# EAGLE design HelveTiny85_3.3V (EAGLE 8.5.2)

## Sheet 1 of 2
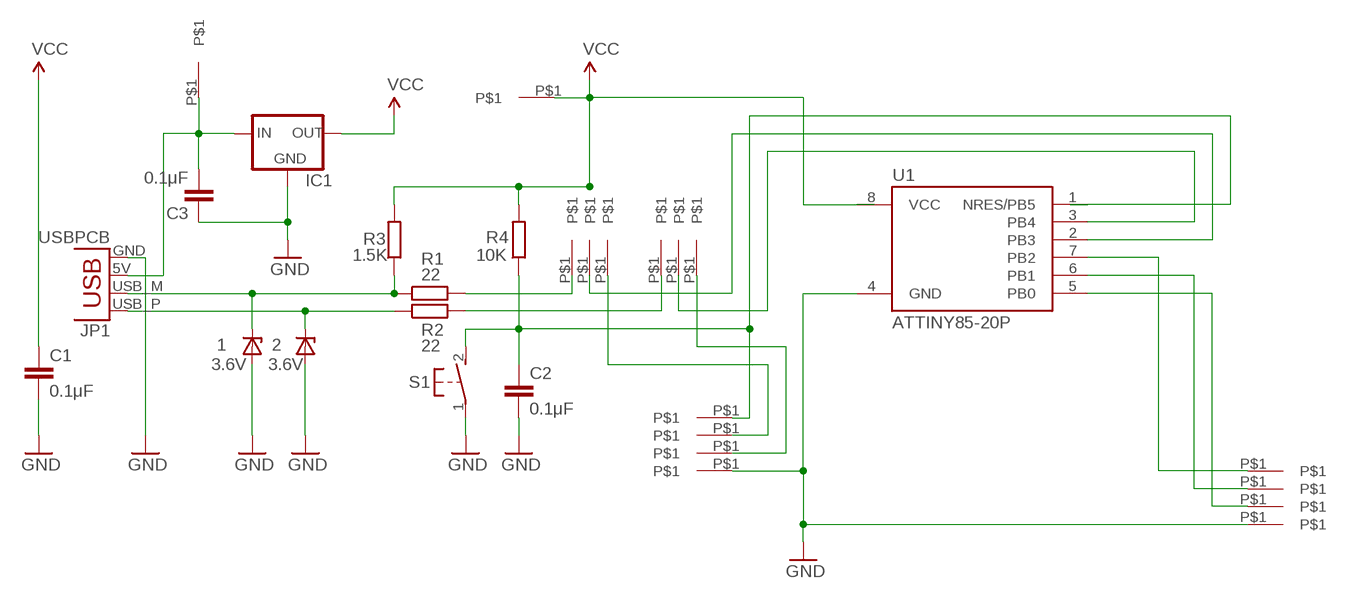
[diagram p0: schematic, sheet 1]

### Parts
1  3.6V  ZENER-DIODEZD-7.5  [ZDIO-7.5]
2  3.6V  ZENER-DIODEZD-7.5  [ZDIO-7.5]
C1  0.1μF  C-EU025-024X044  [C025-024X044]
C2  0.1μF  C-EU025-024X044  [C025-024X044]
C3  0.1μF  C-EU025-024X044  [C025-024X044]
IC1  MCP1700TRI  [TO92]
JP1  USBPCB  [USB-A-PCB]
R1  22  R-EU_0207/7  [0207/7]
R2  22  R-EU_0207/7  [0207/7]
R3  1.5K  R-EU_0207/7  [0207/7]
R4  10K  R-EU_0207/7  [0207/7]
S1  S3  DTS-3  [DTS-3]
TP1  FLOWERPIN  [FLOWERPIN]
TP2  FLOWERPIN  [FLOWERPIN]
TP3  FLOWERPIN  [FLOWERPIN]
TP4  FLOWERPIN  [FLOWERPIN]
TP5  FLOWERPIN  [FLOWERPIN]
TP6  FLOWERPIN  [FLOWERPIN]
TP7  FLOWERPIN  [FLOWERPIN]
TP8  FLOWERPIN  [FLOWERPIN]
TP29  FLOWERPIN  [FLOWERPIN]
TP30  FLOWERPIN  [FLOWERPIN]
TP31  FLOWERPIN  [FLOWERPIN]
TP32  FLOWERPIN  [FLOWERPIN]
TP33  FLOWERPIN  [FLOWERPIN]
TP34  FLOWERPIN  [FLOWERPIN]
TP35  FLOWERPIN  [FLOWERPIN]
TP36  FLOWERPIN  [FLOWERPIN]
U1  ATTINY85-20P  [PDIP08_300MIL]

### Nets
GND: 1.A 2.A C1.2 C2.2 C3.1 IC1.1(GND) JP1.GND S1.1 TP7.P$1 TP32.P$1 U1.4(GND)
N$1: R1.2 TP2.P$1
N$2: TP1.P$1 TP3.P$1
N$5: TP6.P$1 TP31.P$1
N$6: R2.2 TP4.P$1
PB0: TP35.P$1 U1.5(PB0)
PB1: TP34.P$1 U1.6(PB1)
PB2: TP33.P$1 U1.7(PB2)
RESET: C2.1 R4.1 S1.2 TP29.P$1 U1.1(NRES/PB5)
USB-IN-M: 1.C JP1.USB_M(D-) R1.1 R3.1
USB-IN-P: 2.C JP1.USB_P(D+) R2.1
USB-M: TP30.P$1 U1.2(PB3)
USB-P: TP5.P$1 U1.3(PB4)
VCC: C1.1 IC1.3(OUT) R3.2 R4.2 TP36.P$1 U1.8(VCC)
VIN: C3.2 IC1.2(IN) JP1.5V(VBUS) TP8.P$1

## Sheet 2 of 2

## Library data of the parts
1 2 = mod_diode:ZENER-DIODE: Z-Diode
C1-C3 = rcl:C-EU: CAPACITOR, European symbol
IC1 = adafruit:MCP1700: VOLTAGE REGULATOR
JP1 = SparkFun-Connectors:USB: USB Connectors USB-B-PTH is fully proven SKU : PRT-00139/CONN-08278 USB-miniB is fully proven SKU : PRT-00587 USB-A-PCB is untested. USB-A-H is throughly reviewed, but untested. Spark Fun Electronics SKU : PRT-00437 USB-B-SMT is throughly reviewed, but untested. Needs silkscreen touching up. USB-A-S has not been used/tested USB-MB-H has not been used/tested USB-MICROB has been used. CONN-09505
R1-R4 = rcl:R-EU_: RESISTOR, European symbol
S1 = switch-tact:DTS-3
TP1-TP7 TP29-TP36 = ZZFlowerpad:FLOWERPIN: Flower Pad Prototype
TP8 = ZZFlowerpad:FLOWERPIN: Flower Pad Prototype; SPICEPREFIX: X
U1 = _hhn_attiny25_45_85:ATTINY85*: ATMEL ATtiny 85 Packages: P = PDIP 08 30mil S = SOIC 08 EIAJ 208mil Technologies Note: for complete ordering code (temp. range, finish, tape&reel etc.) see www.atmel.com • Supply Voltage: V = (1.8…5.5)V | [blank] = (2.7…5.5)V • Speed: 10 = 10 MHz | 20 = 20 MHz Author: Dipl.-Ing. FH Rainer Bayer HHN Hochschule Heilbronn (Heilbronn University), rainer.bayer@hs-heilbronn.de Ingenieurbüro ing-rb, mail@ing-rb.de

## Board
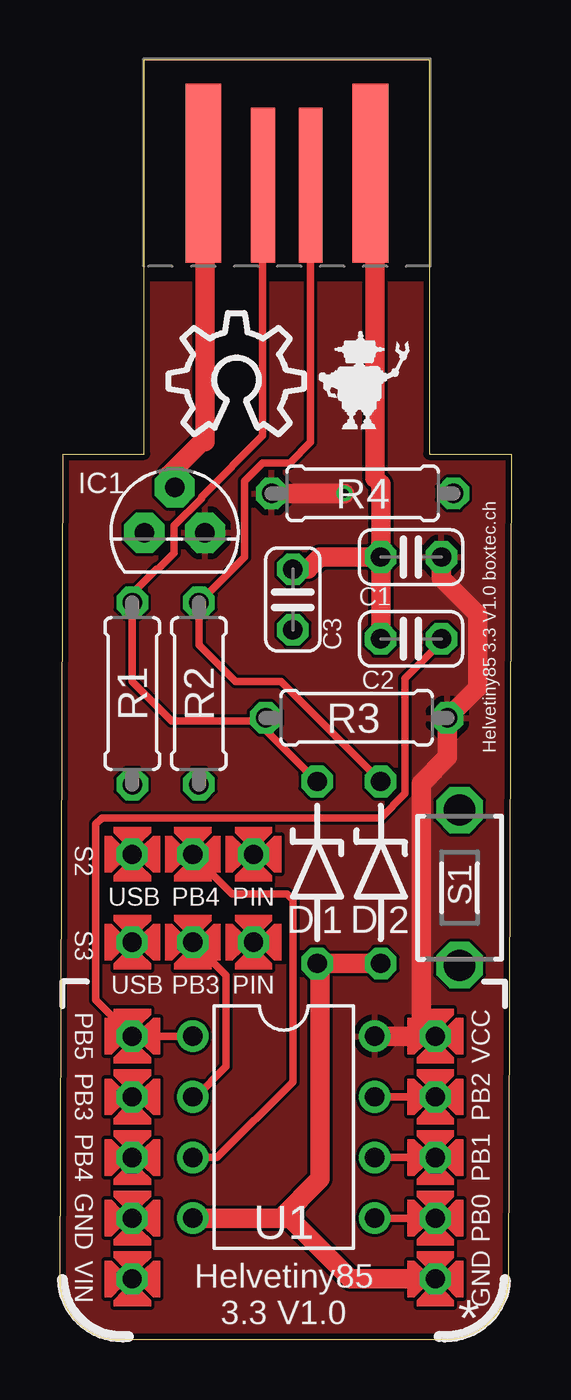
[diagram p1: board, top side]
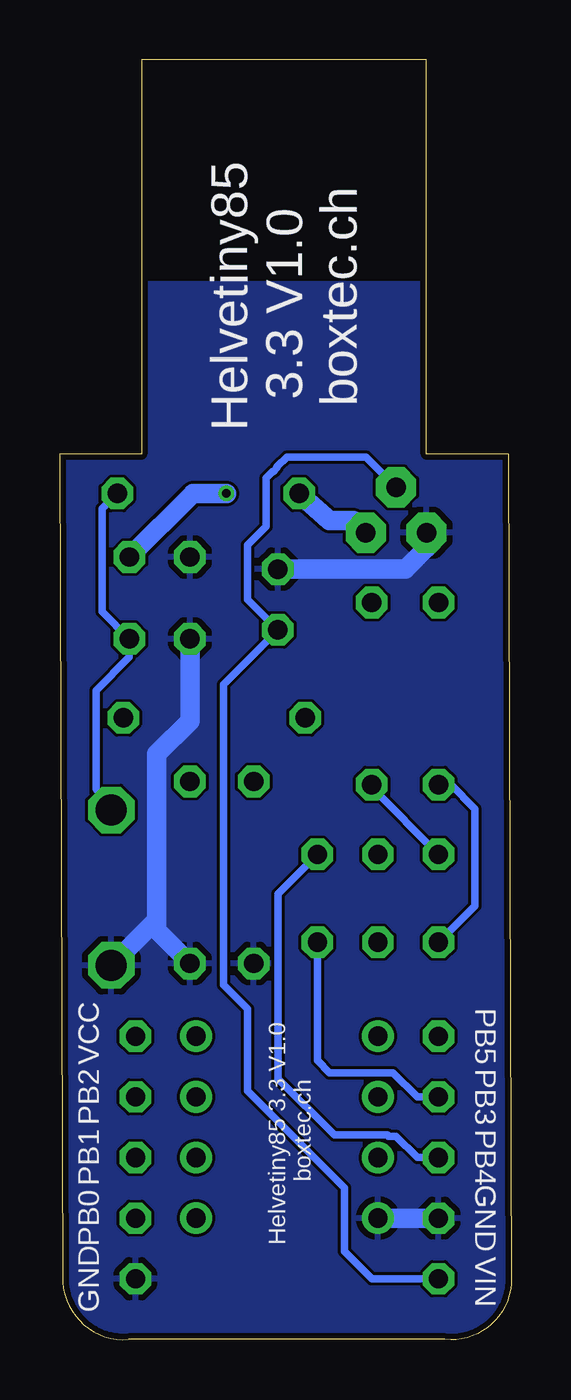
[diagram p2: board, bottom side, seen from below]

Size 18.92 x 53.61 mm. Coordinates in mm from the lower left corner, seen from the top.
Outline: 18.92,37.09 18.8,2.4 arc-90 16.02,0.01 2.77,0.01 arc-90 0,2.28 0.12,37.1
Outline: 18.92,37.1 15.49,37.1 15.49,53.61 3.55,53.61 3.55,37.1 0.12,37.1
Copper layers (1*16): Top 0.035mm / dielectric 1.5mm / Bottom 0.035mm
Design rules "dirt_cheap_dirty_boards.v1": minimum track width 5mil, minimum drill 12mil, track to track 5mil, track to pad 5mil, pad to pad 5mil, via to via 5mil, smd to smd 0mil, copper to edge 10mil, drill to drill 10mil, minimum pad ring 10mil, minimum via ring 6mil, stop-mask expansion 2mil, vias tented up to drill 25mil, thermal gap 10mil

### Footprints (pad centres in the part's own frame; a part is rotated, then mirrored left to right if it is on the bottom)
ZDIO-7.5 = drill 0.813 octagon: A 3.81,0; C -3.81,0
C025-024X044 = drill 0.813 octagon: 1 -1.27,0; 2 1.27,0
TO92 = drill 0.813 pad 1.676 octagon: 1 -1.27,0; 2 0,1.905; 3 1.27,0
USB-A-PCB = smd 7.5 x 1.5: 5V -0.2,-3.5; GND -0.2,3.5 | smd 6.5 x 1: USB_M 0.3,-1; USB_P 0.3,1
0207/7 = drill 0.813 octagon: 1 -3.81,0; 2 3.81,0
DTS-3 = drill 1.3 octagon: 1 -3.25,0; 2 3.25,0
FLOWERPIN = drill 0.8 octagon: P$1 0,0
PDIP08_300MIL = drill 0.813: 1 -3.81,-3.81; 2 -1.27,-3.81; 3 1.27,-3.81; 4 3.81,-3.81; 5 3.81,3.81; 6 1.27,3.81; 7 -1.27,3.81; 8 -3.81,3.81

### Placement (x,y rotation side)
1  10.79,19.57 270 top
2  13.45,19.57 270 top
C1  14.72,32.78 180 top
C2  14.72,29.35 180 top
C3  9.77,31 270 top
IC1  4.82,33.79 0 top
JP1  9.52,48.65 270 top
R1  3.04,27.06 270 top
R2  5.83,27.06 270 top
R3  12.44,26.05 0 top
R4  12.69,35.45 180 top
S1  16.76,18.94 90 top
TP1  8.12,16.65 0 top
TP2  3.04,16.65 0 top
TP3  3.04,10.17 0 top
TP4  3.04,20.33 0 top
TP5  5.58,20.33 0 top
TP6  8.12,20.33 0 top
TP7  15.74,2.55 0 top
TP8  3.04,2.55 0 top
TP29  3.04,12.71 0 top
TP30  5.58,16.65 0 top
TP31  3.04,7.63 0 top
TP32  3.04,5.09 0 top
TP33  15.74,10.17 0 top
TP34  15.74,7.63 0 top
TP35  15.74,5.09 0 top
TP36  15.74,12.71 0 top
U1  9.39,8.9 270 top
U$1  [OSHW_10X200_NOTEXT]  4.56,37.92 0 top

### Tracks (layer width: path | path; a pad name or v marks a point on that pad's centre or on a via)
GND
  Top 0.813: 2.A 1.A 10.91,15.63 10.91,6.74 9.26,5.09 | C1.2 C2.2 | C1.2 13.45,35.83 13.2,36.08 13.2,48.67 JP1.GND | C3.1 10.41,32.27 10.91,32.78 C1.2 | U1.4 9.26,5.09 | 9.26,5.09 9.64,5.09 12.18,2.55 TP7.P$1
  Bottom 0.813: TP32.P$1 U1.4 | C2.2 13.45,25.92 14.85,24.52 14.85,17.59 | 14.85,17.59 S1.1 | 14.85,17.59 14.85,17.16 2.A | IC1.1 3.55,33.16 4.44,32.27 C3.1
  pour Bottom: 3.68,44.21 15.36,44.21 15.36,36.97 18.79,36.97 18.67,2.38 arc-90 16.04,0.14 2.59,0.14 arc-90 0.13,2.23 0.25,36.97 3.68,36.97
N$1
  Bottom 0.305: R1.2 2.53,23.25 1.52,22.24 1.52,18.17 TP2.P$1
N$2
  Bottom 0.305: TP3.P$1 3.93,10.17 4.95,11.19 7.61,11.19 8.12,11.7 TP1.P$1
N$5
  Bottom 0.305: TP31.P$1 3.93,7.63 4.82,8.52 5.14,8.52 5.19,8.57 7.41,8.57 9.77,10.93 9.77,18.68 TP6.P$1
N$6
  Bottom 0.305: R2.2 5.83,23.13 TP4.P$1
PB0
  Top 0.305: U1.5 TP35.P$1
PB1
  Top 0.305: U1.6 TP34.P$1
PB2
  Top 0.305: U1.7 TP33.P$1
RESET
  Top 0.305: U1.1 TP29.P$1 1.52,14.24 1.52,21.6 1.77,21.86 13.45,21.86 14.47,22.87 14.47,27.7 15.99,29.22 C2.1
  Bottom 0.305: R4.1 17.14,34.81 17.14,30.49 C2.1 15.99,28.59 17.39,27.19 17.39,23.07 S1.2
USB-IN-M
  Top 0.305: 1.C 8.63,25.54 R3.1 8.5,25.92 4.69,25.92 3.04,27.57 R1.1 3.04,31.25 4.06,32.27 4.18,32.34 4.79,32.95 4.79,34.09 5.94,35.24 5.94,35.29 8.5,37.86 8.5,46.37 | 8.5,46.37 8.5,46.88 | 8.5,46.37 8.52,46.38 JP1.USB_M
USB-IN-P
  Top 0.305: JP1.USB_P 10.52,37.59 9.64,36.72 8.5,36.72 7.74,35.95 7.74,32.78 R2.1 5.83,29.1 7.36,27.57 9.26,27.57 2.C
USB-M
  Top 0.305: U1.2 5.71,10.17 6.98,11.44 6.98,15.25 TP30.P$1
USB-P
  Top 0.305: U1.3 6.6,7.63 9.77,10.81 9.77,18.43 9.52,18.68 7.23,18.68 TP5.P$1
VCC  (via drill 0.35)
  Top 0.813: U1.8 TP36.P$1 15.16,13.3 15.16,23.3 16.25,24.4 R3.2 17.52,27.32 17.52,30.37 15.99,31.89 C1.1 | R4.2 v11.93,35.45
  Bottom 0.813: R4.2 7.61,34.3 6.6,34.3 IC1.3 | v11.93,35.45 13.33,35.45 C1.1
  pour Top: 3.68,44.21 15.36,44.21 15.36,36.97 18.79,36.97 18.67,2.43 arc-90 15.99,0.14 2.66,0.14 arc-90 0.13,2.3 0.25,36.97 3.68,36.97
VIN
  Top 0.813: JP1.5V 6.09,48.78 6.09,37.6 5.96,37.6 4.56,36.21 4.56,35.95 IC1.2
  Bottom 0.305: IC1.2 6.09,36.97 9.39,36.97 9.8,36.56 9.8,36.53 9.97,36.36 10,36.36 10.28,36.08 10.28,34.05 11.04,33.29 11.04,31 C3.2 12.06,27.44 12.06,14.87 11.04,13.86 11.04,10.43 6.98,6.36 6.98,3.7 5.83,2.55 TP8.P$1

### Text on the board
tNames: Helvetiny85 3.3 V1.0 boxtec.ch | S2 | USB | PB4 | PIN | S3 | D | D | USB | PB3 | PIN | PB5 | VCC | PB3 | PB2 | PB4 | PB1 | PB0 | GND | VIN | GND | Helvetiny85 / 3.3 V1.0 | *
bNames: Helvetiny85 / 3.3 V1.0 / boxtec.ch | PB5 | VCC | PB3 | PB2 | Helvetiny85 3.3 V1.0 / boxtec.ch | PB4 | PB1 | GND | PB0 | VIN | GND